# Altium project Snap2.PrjPCB
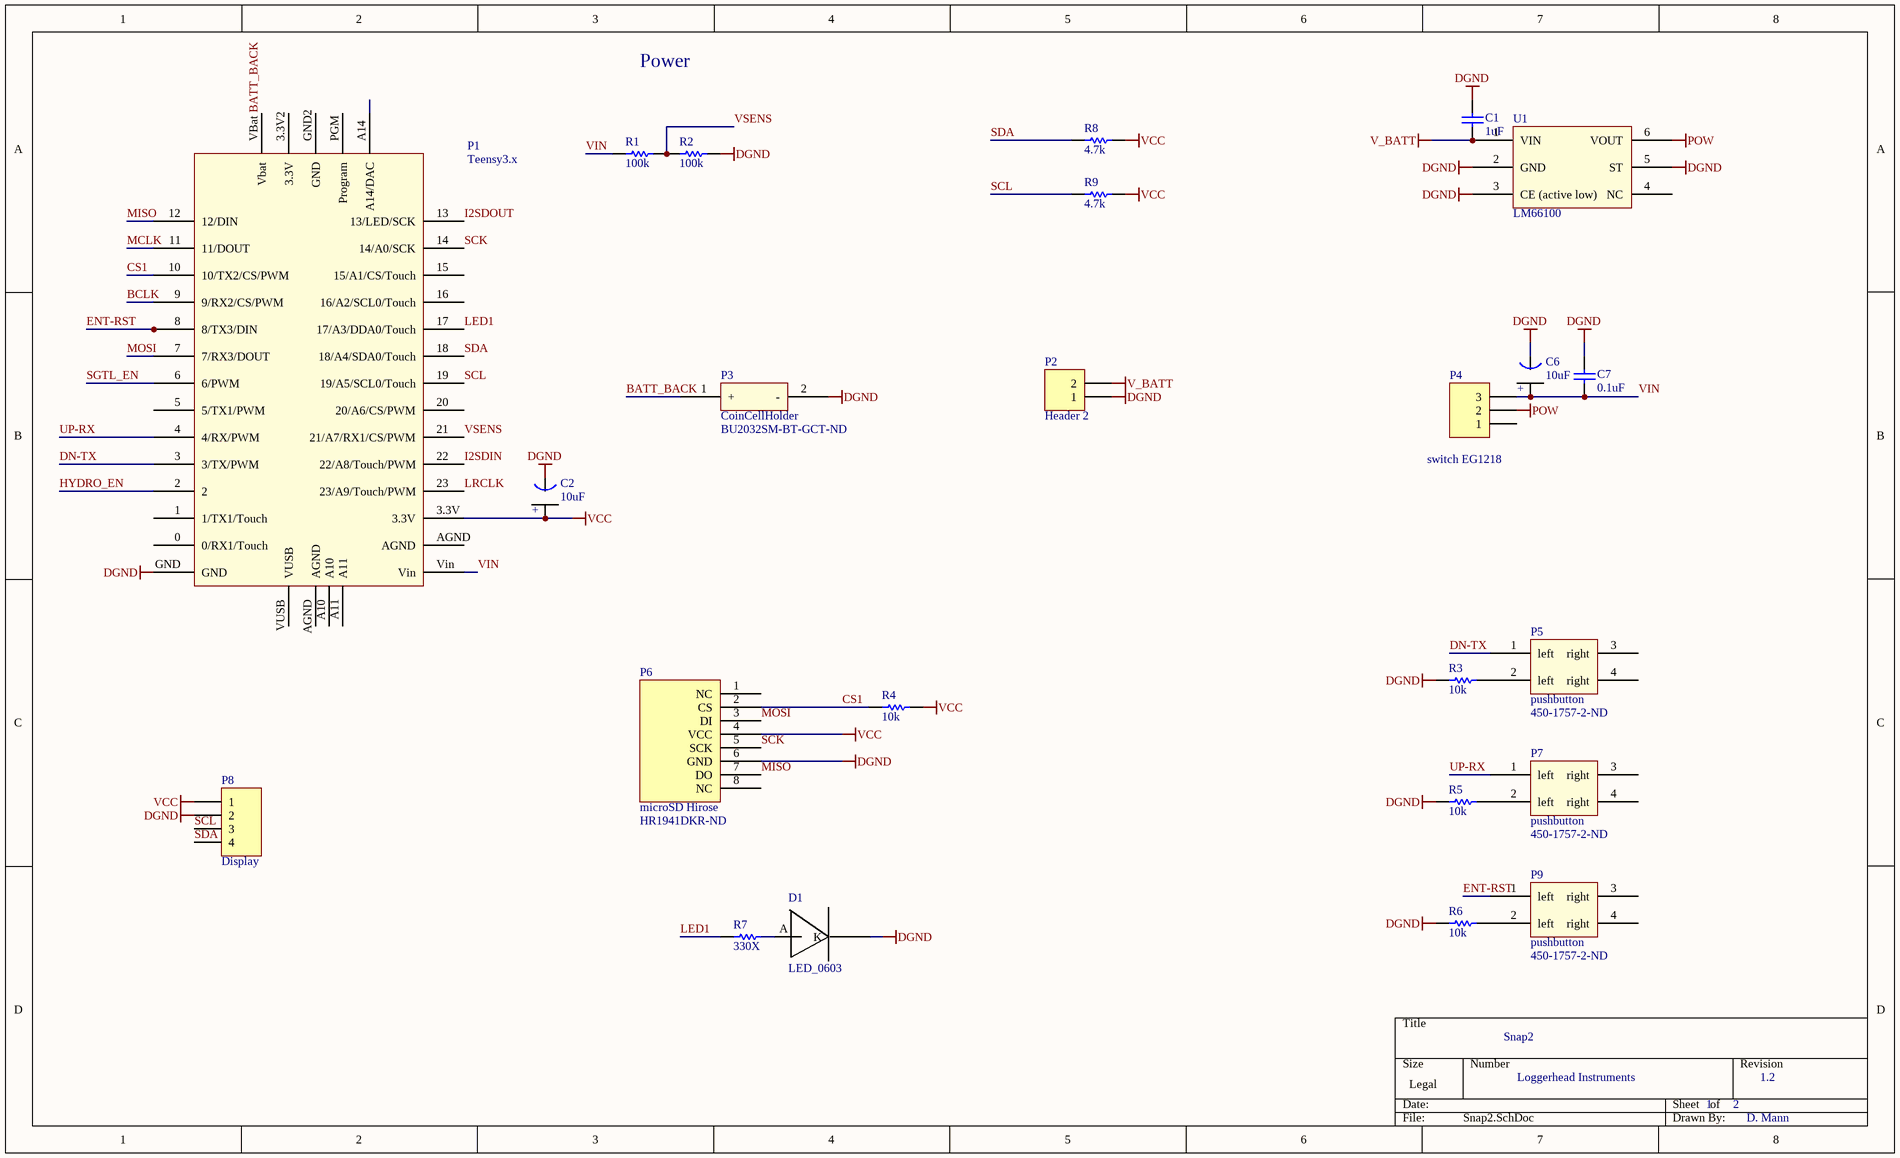
[diagram p0: Snap2.SchDoc]
2 sheets, 50 parts. Net scope: global (net labels, ports and power ports of the same name join across sheets).
Board file: Snap2.PcbDoc
Sheets:
  Snap2.SchDoc
  Snap2_audio.SchDoc

## Sheet Snap2.SchDoc
size Legal

### Parts
C1  1uF  [0402]
C2  10uF  [Tant0805]
C6  10uF  [Tant0805]
C7  0.1uF  [0402]
D1  LED_0603  [Diode0603]
P1  Teensy3.x  [Teensy3.x]
P2  Header 2  [HDR1X2]
P3  CoinCellHolder  Supplier Part Number 1: BU2032SM-BT-GCT-ND  [CoinCellHolder]
P4  switch EG1218  [HDR1X3]
P5  pushbutton  Supplier Part Number 1: 450-1757-2-ND  [SOP4]
P6  microSD Hirose  Supplier Part Number 1: HR1941DKR-ND  [DM3D microSD]
P7  pushbutton  Supplier Part Number 1: 450-1757-2-ND  [SOP4]
P8  Display  [HDR1X4]
P9  pushbutton  Supplier Part Number 1: 450-1757-2-ND  [SOP4]
R1  100k  [3-0603]
R2  100k  [3-0603]
R3  10k  [3-0603]
R4  10k  [3-0603]
R5  10k  [3-0603]
R6  10k  [3-0603]
R7  330X  [3-0603]
R8  4.7k  [3-0603]
R9  4.7k  [3-0603]
U1  LM66100  [SC-70-6]

### Nets
DGND: C1.1 C2.1(GND) C6.1(GND) C7.2 D1.K P1.GND P2.1 P3.2(-) P6.6(GND) P8.2 R2.1 R3.2 R5.2 R6.2 U1.2(GND) U1.3(CE_(active_low)) U1.5(ST)
POW: P4.2 U1.6(VOUT)
V_BATT: C1.2 P2.2 U1.1(VIN)
VCC: C2.2(+) P1.3.3V P6.4(VCC) P8.1 R4.1 R8.2 R9.2
BATT_BACK: P1.VBat(Vbat) P3.1(+)
BCLK: P1.9(9/RX2/CS/PWM)
CS1: P1.10(10/TX2/CS/PWM) P6.2(CS) R4.2
DN-TX: P1.3(3/TX/PWM) P5.1(left)
ENT-RST: P1.8(8/TX3/DIN) P9.1(left)
HYDRO_EN: P1.2
I2SDIN: P1.22(22/A8/Touch/PWM)
I2SDOUT: P1.13(13/LED/SCK)
LED1: P1.17(17/A3/DDA0/Touch) R7.1
LRCLK: P1.23(23/A9/Touch/PWM)
MCLK: P1.11(11/DOUT)
MISO: P1.12(12/DIN) P6.7(DO)
MOSI: P1.7(7/RX3/DOUT) P6.3(DI)
SCK: P1.14(14/A0/SCK) P6.5(SCK)
SCL: P1.19(19/A5/SCL0/Touch) P8.3 R9.1
SDA: P1.18(18/A4/SDA0/Touch) P8.4 R8.1
SGTL_EN: P1.6(6/PWM)
UP-RX: P1.4(4/RX/PWM) P7.1(left)
VIN: C6.2(+) C7.1 P1.Vin P4.3 R1.2
VSENS: P1.21(21/A7/RX1/CS/PWM) R1.1 R2.2
NetD1_A: D1.A R7.2
NetP5_2: P5.2(left) R3.1
NetP7_2: P7.2(left) R5.1
NetP9_2: P9.2(left) R6.1

Not connected (* = marked no-connect by the designer): P1 0(0/RX1/Touch) 1(1/TX1/Touch) 3.3V2(3.3V) 5(5/TX1/PWM) 15(15/A1/CS/Touch) 16(16/A2/SCL0/Touch) 20(20/A6/CS/PWM) A10 A11 A14(A14/DAC) AGND GND2(GND) PGM(Program) VUSB; P4 1; P5 3(right) 4(right); P6 1(NC) 8(NC); P7 3(right) 4(right); P9 3(right) 4(right); U1 4(NC)

### Notes on the sheet
- Power
- Snap2
- Loggerhead Instruments
- 1
- 2
- 1.2
- D. Mann

### Library data of the parts
C1 = C0402: Ceramic Chip Capacitor - Standard; Note: Footprint corresponds to dimensions for bulk cassette packaging. This case size has tightened tolerances.; Value: 0.1uF; Published: 17-Jul-2002; LatestRevisionDate: 19-Mar-2004; LatestRevisionNote: Silkscreen size reduced.; DatasheetDocument: Mar-2001; PackageDocument: Mar-2001; PackageReference: 0402; Publisher: Altium Limited; Code_JEITA: 0402; Code_IPC: 1005 [0402]; ComponentLink1Description: Manufacturer Link; ComponentLink1URL: http://www.kemet.com/; ComponentLink2Description: Datasheet; ComponentLink2URL: http://www.kemet.com/kemet/web/homepage/kechome.nsf/vapubfilesname/F3102TA.pdf/$file/F3102TA.pdf
C2 C6 = Tant0805: Value: 10uF
C7 = C0402: Ceramic Chip Capacitor - Standard; Note: Footprint corresponds to dimensions for bulk cassette packaging. This case size has tightened tolerances.; Published: 17-Jul-2002; LatestRevisionDate: 19-Mar-2004; LatestRevisionNote: Silkscreen size reduced.; DatasheetDocument: Mar-2001; PackageDocument: Mar-2001; PackageReference: 0402; Publisher: Altium Limited; Code_JEITA: 0402; Code_IPC: 1005 [0402]; ComponentLink1Description: Manufacturer Link; ComponentLink1URL: http://www.kemet.com/; ComponentLink2Description: Datasheet; ComponentLink2URL: http://www.kemet.com/kemet/web/homepage/kechome.nsf/vapubfilesname/F3102TA.pdf/$file/F3102TA.pdf; Value: 0.1uF
P2 = Header 2: Header, 2-Pin; LatestRevisionDate: 17-Jul-2002; LatestRevisionNote: Re-released for DXP Platform.; Publisher: Altium Limited
P4 = Header 3: Header, 3-Pin; LatestRevisionDate: 17-Jul-2002; LatestRevisionNote: Re-released for DXP Platform.; Publisher: Altium Limited
P8 = Header 4: Header, 4-Pin; LatestRevisionDate: 17-Jul-2002; LatestRevisionNote: Re-released for DXP Platform.; Publisher: Altium Limited
R1-R9 = ERJ3RK: Precision Thick Film Chip Resistor, 10 Ohm to 1M Ohm Range, 1% and 0.5% Tolerance, 0603 Size, 0.063 W; Published: 17-Dec-2003; LatestRevisionDate: 19-Mar-2004; LatestRevisionNote: Silkscreen size reduced.; PackageDocument: Mar-2003; PackageReference: 3-0603; Publisher: Altium Limited; Code_IPC: 1608 [0603]; ComponentLink1Description: Manufacturer Link; ComponentLink1URL: http://www.panasonic.com/industrial/components/resistive_products.htm; ComponentLink2Description: Datasheet; ComponentLink2URL: http://www.panasonic.com/industrial/components/pdf/AOA0000CE2.pdf
P3 = CoinCellHolder: Supplier 1: Digi-Key
P5 P7 P9 = pushbutton: Supplier 1: Digi-Key
P6 = microSD Hirose: Supplier 1: Digi-Key

## Sheet Snap2_audio.SchDoc
size A
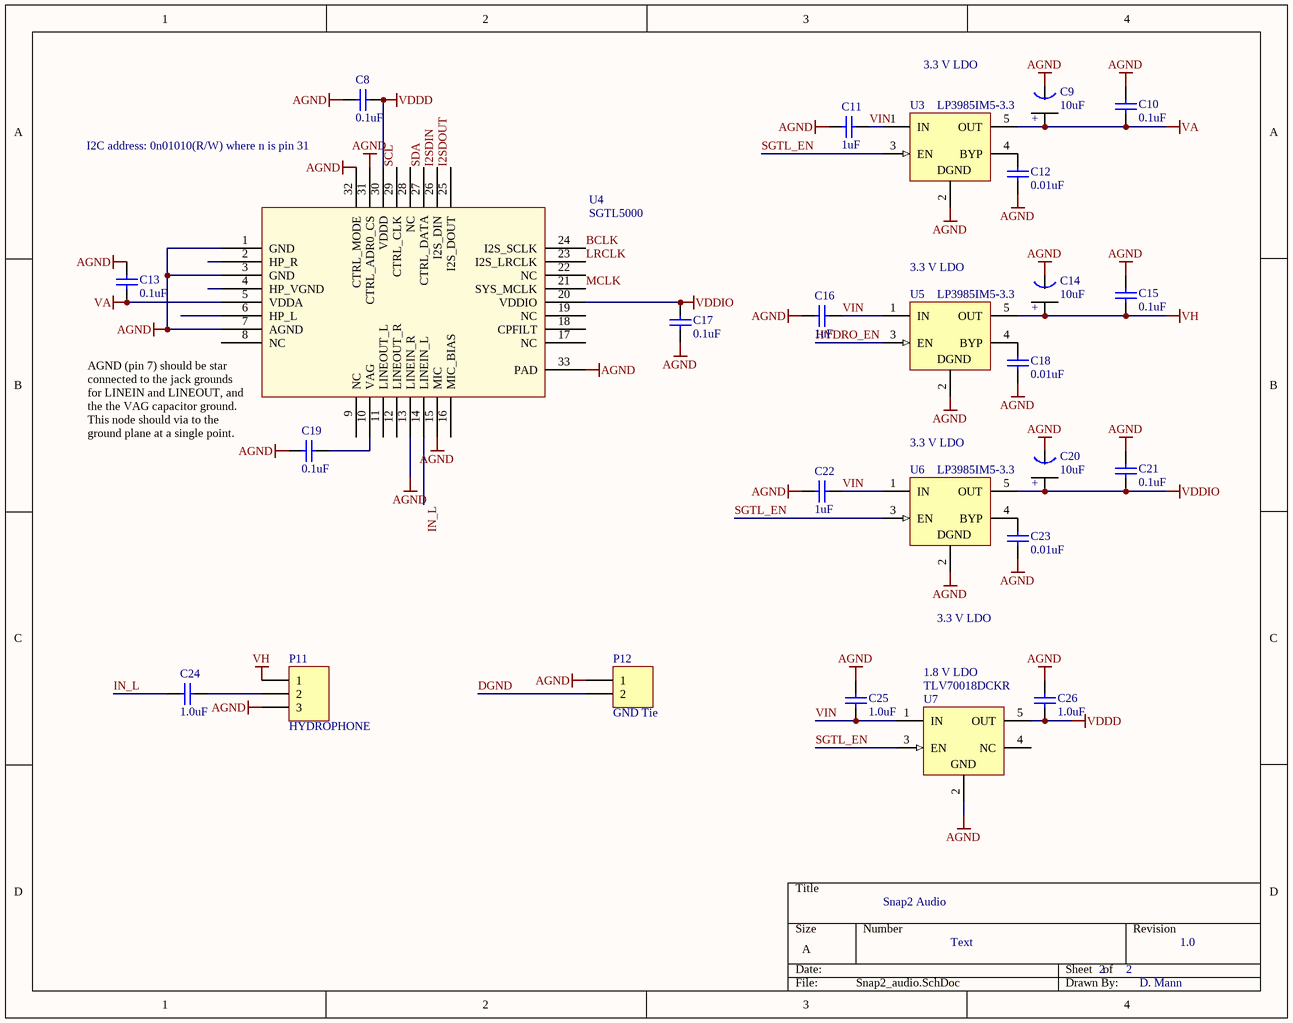
[diagram p1: Snap2_audio.SchDoc]

### Parts
C8  0.1uF  [0402]
C9  10uF  [Tant0805]
C10  0.1uF  [0402]
C11  1uF  [0402]
C12  0.01uF  [0402]
C13  0.1uF  [0402]
C14  10uF  [Tant0805]
C15  0.1uF  [0402]
C16  1uF  [0402]
C17  0.1uF  [0402]
C18  0.01uF  [0402]
C19  0.1uF  [0402]
C20  10uF  [Tant0805]
C21  0.1uF  [0402]
C22  1uF  [0402]
C23  0.01uF  [0402]
C24  1.0uF  [0402]
C25  1.0uF  [0402]
C26  1.0uF  [0402]
P11  HYDROPHONE  [HDR1X3]
P12  GND Tie  [HDR1X2]
U3  LP3985IM5-3.3  [MF05A_N]
U4  SGTL5000  [QFN32]
U5  LP3985IM5-3.3  [MF05A_N]
U6  LP3985IM5-3.3  [MF05A_N]
U7  TLV70018DCKR  [TI-DCK5_V]

### Nets
AGND: C8.2 C9.1(GND) C10.2 C11.2 C12.2 C13.2 C14.1(GND) C15.2 C16.2 C17.2 C18.2 C19.2 C20.1(GND) C21.2 C22.2 C23.2 C25.2 C26.2 P11.3 P12.1 U3.2(GND) U4.1(GND) U4.3(GND) U4.7(AGND) U4.13(LINEIN_R) U4.15(MIC) U4.31(CTRL_ADR0_CS) U4.32(CTRL_MODE) U4.33(PAD) U5.2(GND) U6.2(GND) U7.2(GND)
DGND: P12.2
VA: C9.2(+) C10.1 C13.1 U3.5(OUT) U4.5(VDDA)
VDDD: C8.1 C26.1 U4.30(VDDD) U7.5(OUT)
VDDIO: C17.1 C20.2(+) C21.1 U4.20(VDDIO) U6.5(OUT)
VH: C14.2(+) C15.1 P11.1 U5.5(OUT)
BCLK: U4.24(I2S_SCLK)
HYDRO_EN: U5.3(EN)
I2SDIN: U4.26(I2S_DIN)
I2SDOUT: U4.25(I2S_DOUT)
IN_L: C24.2 U4.14(LINEIN_L)
LRCLK: U4.23(I2S_LRCLK)
MCLK: U4.21(SYS_MCLK)
SCL: U4.29(CTRL_CLK)
SDA: U4.27(CTRL_DATA)
SGTL_EN: U3.3(EN) U6.3(EN) U7.3(EN)
VIN: C11.1 C16.1 C22.1 C25.1 U3.1(IN) U5.1(IN) U6.1(IN) U7.1(IN)
NetC12_1: C12.1 U3.4(BYP)
NetC18_1: C18.1 U5.4(BYP)
NetC19_1: C19.1 U4.10(VAG)
NetC23_1: C23.1 U6.4(BYP)
NetC24_1: C24.1 P11.2

Not connected (* = marked no-connect by the designer): U4 2(HP_R) 4(HP_VGND) 6(HP_L) 8(NC) 9(NC) 11(LINEOUT_L) 12(LINEOUT_R) 16(MIC_BIAS) 17(NC) 18(CPFILT) 19(NC) 22(NC) 28(NC); U7 4(NC)

### Notes on the sheet
- 3.3 V LDO
- I2C address: 0n01010(R/W) where n is pin 31
- (near U5) 3.3 V LDO
- (near U4) AGND (pin 7) should be star connected to the jack grounds for LINEIN and LINEOUT, and the the VAG capacitor ground. This node should via to the ground plane at a single point.
- (near U6) 3.3 V LDO
- (near U7) 1.8 V LDO
- Snap2 Audio
- Text
- 2
- 1.0
- D. Mann
- (in symbol LP3985IM5-3.3) DGND

### Library data of the parts
C8 C10 C13 C15 C17 C19 C21 = C0402: as C7 on sheet Snap2; Published: 17-Jul-2002; LatestRevisionDate: 19-Mar-2004; LatestRevisionNote: Silkscreen size reduced.; DatasheetDocument: Mar-2001; PackageDocument: Mar-2001; PackageReference: 0402; Publisher: Altium Limited; Code_JEITA: 0402; Code_IPC: 1005 [0402]; ComponentLink1Description: Manufacturer Link; ComponentLink1URL: http://www.kemet.com/; ComponentLink2Description: Datasheet; ComponentLink2URL: http://www.kemet.com/kemet/web/homepage/kechome.nsf/vapubfilesname/F3102TA.pdf/$file/F3102TA.pdf; Value: 0.1uF
C9 C14 C20 = Tant0805: Value: 10uF
C11 C12 C16 C18 C22-C26 = C0402: as C1 on sheet Snap2; Published: 17-Jul-2002; LatestRevisionDate: 19-Mar-2004; LatestRevisionNote: Silkscreen size reduced.; DatasheetDocument: Mar-2001; PackageDocument: Mar-2001; PackageReference: 0402; Publisher: Altium Limited; Code_JEITA: 0402; Code_IPC: 1005 [0402]; ComponentLink1Description: Manufacturer Link; ComponentLink1URL: http://www.kemet.com/; ComponentLink2Description: Datasheet; ComponentLink2URL: http://www.kemet.com/kemet/web/homepage/kechome.nsf/vapubfilesname/F3102TA.pdf/$file/F3102TA.pdf
P11 = Header 3: Header, 3-Pin; LatestRevisionDate: 17-Jul-2002; LatestRevisionNote: Re-released for DXP Platform.; Publisher: Altium Limited
P12 = Header 2: Header, 2-Pin; LatestRevisionDate: 17-Jul-2002; LatestRevisionNote: Re-released for DXP Platform.; Publisher: Altium Limited
U3 U5 U6 = LP3985IM5-3.3: Micropower, 150mA Low-Noise Ultra Low-Dropout CMOS Voltage Regulator; Manufacturer: National Semiconductor; CompType: LDO IC; PackageTopMarking: LDQB*XTT; PowerWise: N; Published: 4-Dec-2008; DatasheetVersion: Aug-2005; PackageVersion: revD, Aug-2008; PackageReference: MF05A; Publisher: Altium Limited; PackageDescription: Molded SOT-23, .115 x .063 x .040 in Body, 5 Lead, .0375 in Pitch; PartNumber: LP3985IM5-3.3; RoHS: O; PinCount: 5; DigiKeyPartNumber: LP3985IM5-3.3CT-ND; ComponentLink1Description: LP3985 Datasheet; ComponentLink1URL: http://www.national.com/ds/LP/LP3985.pdf; ComponentLink2Description: LP3985 Web Page; ComponentLink2URL: http://www.national.com/pf/LP/LP3985.html; ComponentLink3Description: MF05A Package Page; ComponentLink3URL: http://www.national.com/packaging/folders/mf05a.html
U7 = TLV70018DCKR: Single Output LDO, 200 mA, Fixed 1.8 V Output, 2 to 5.5 V Input, with Low IQ, 5-pin SC70 (DCK), -40 to 125 degC, Green (RoHS & no Sb/Br); Manufacturer: Texas Instruments; Accuracy(%): 2; Fixed Output Options(V): 1.8; Iout(Max)(A): 0.2; Iq(Typ)(mA): 0.03; SubFamily: Single Channel LDO; Vdo(Typ)(mV): 175; Vin(Max)(V): 5.5; DatasheetVersion: SLVSA00D; PackageVersion: 4093553-3/G; PackageReference: DCK5; PackageDescription: 5-Pin Plastic Small-Outline, Body 2 x 1.25 mm, Pitch 0.65 mm; Supplier 1: Digi-Key; Supplier Part Number 1: 296-32409-2-ND; Supplier 2: Digi-Key; Supplier Part Number 2: 296-32409-1-ND; Supplier 3: Digi-Key; Supplier Part Number 3: 296-32409-6-ND; Supplier 4: Newark; Supplier Part Number 4: 55R7461; Supplier 5: Mouser; Supplier Part Number 5: 595-TLV70018DCKR; Eco-Plan: Green (RoHS & no Sb/Br); Vin(Min)(V): 2; Vout Adj(Max)(V): 1.8; Vout Adj(Min)(V): 1.8; Mounting Technology: Surface Mount; Code_JEDEC: MO-203; PartNumber: TLV70018DCKR; ComponentLink1Description: Manufacturer URL; ComponentLink1URL: http://www.ti.com/; ComponentLink2Description: Datasheet; ComponentLink2URL: http://www.ti.com/general/docs/lit/getliterature.tsp?genericPartNumber=TLV70018&fileType=pdf; ComponentLink3Description: Package Specification; ComponentLink3URL: http://www.ti.com/litv/pdf/mpds025f

## Nets that join several sheets
DGND: Snap2 (17 pins), Snap2_audio (P12.2)
BCLK: Snap2 (P1.9), Snap2_audio (U4.24)
HYDRO_EN: Snap2 (P1.2), Snap2_audio (U5.3)
I2SDIN: Snap2 (P1.22), Snap2_audio (U4.26)
I2SDOUT: Snap2 (P1.13), Snap2_audio (U4.25)
LRCLK: Snap2 (P1.23), Snap2_audio (U4.23)
MCLK: Snap2 (P1.11), Snap2_audio (U4.21)
SCL: Snap2 (P1.19 P8.3 R9.1), Snap2_audio (U4.29)
SDA: Snap2 (P1.18 P8.4 R8.1), Snap2_audio (U4.27)
SGTL_EN: Snap2 (P1.6), Snap2_audio (U3.3 U6.3 U7.3)
VIN: Snap2 (5 pins), Snap2_audio (8 pins)